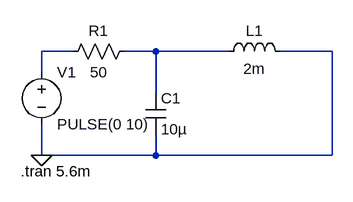
[diagram p0: schematic pulse train.asc]
pulse train.asc, the LTspice schematic file:
Version 4
SHEET 1 880 680
WIRE 64 96 16 96
WIRE 192 96 144 96
WIRE 304 96 192 96
WIRE 464 96 384 96
WIRE 16 128 16 96
WIRE 192 160 192 96
WIRE 16 256 16 208
WIRE 192 256 192 224
WIRE 192 256 16 256
WIRE 464 256 464 96
WIRE 464 256 192 256
FLAG 16 256 0
SYMBOL res 160 80 R90
WINDOW 0 0 56 VBottom 2
WINDOW 3 32 56 VTop 2
SYMATTR InstName R1
SYMATTR Value 50
SYMBOL cap 176 160 R0
SYMATTR InstName C1
SYMATTR Value 10µ
SYMBOL ind 288 112 R270
WINDOW 0 32 56 VTop 2
WINDOW 3 5 56 VBottom 2
SYMATTR InstName L1
SYMATTR Value 2m
SYMBOL voltage 16 112 R0
WINDOW 123 0 0 Left 2
WINDOW 39 0 0 Left 2
SYMATTR InstName V1
SYMATTR Value PULSE(0 10)
TEXT -16 280 Left 2 !.tran 5.6m

The netlist it stands for:
* pulse train.asc
R1 N002 N001 50
C1 N002 0 10µ
L1 N002 0 2m
V1 N001 0 PULSE(0 10)
.tran 5.6m
.backanno
.end